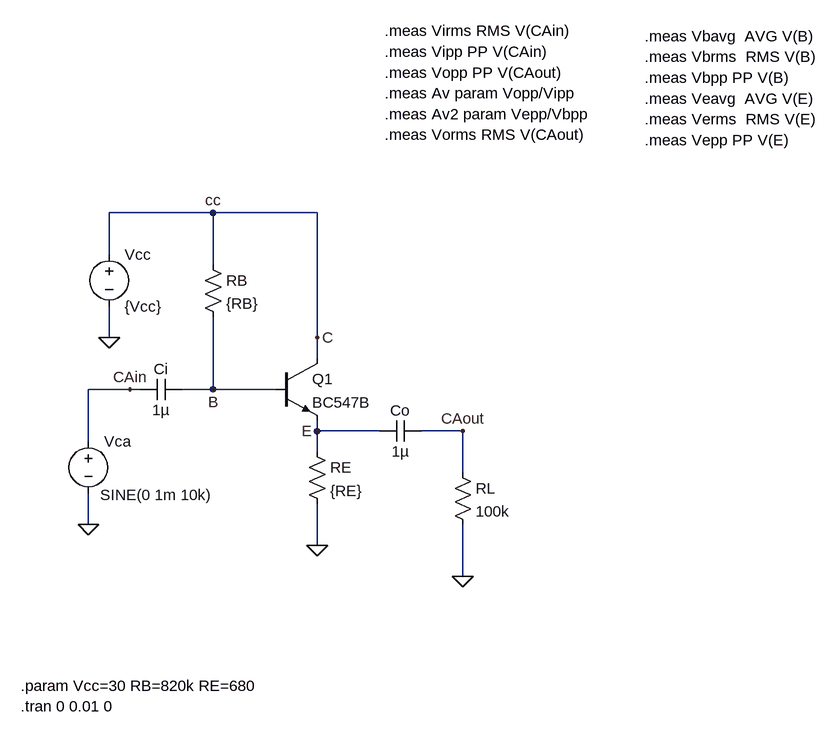
[diagram p0: schematic TBJ03CA.asc]
TBJ03CA.asc, the LTspice schematic file:
Version 4
SHEET 1 1652 1200
WIRE 128 -16 -32 -16
WIRE 288 -16 128 -16
WIRE -32 48 -32 -16
WIRE 128 64 128 -16
WIRE -32 176 -32 128
WIRE 288 176 288 -16
WIRE 288 208 288 176
WIRE 0 256 -64 256
WIRE 16 256 0 256
WIRE 128 256 128 144
WIRE 128 256 80 256
WIRE 224 256 128 256
WIRE 288 320 288 304
WIRE 384 320 288 320
WIRE 512 320 448 320
WIRE -64 336 -64 256
WIRE 288 352 288 320
WIRE 512 384 512 320
WIRE -64 464 -64 416
WIRE 288 496 288 432
WIRE 512 544 512 464
FLAG -32 176 0
FLAG 288 496 0
FLAG -64 464 0
FLAG 128 -16 cc
FLAG 0 256 CAin
FLAG 512 544 0
FLAG 512 320 CAout
FLAG 128 256 B
FLAG 288 176 C
FLAG 288 320 E
SYMBOL res 112 48 R0
SYMATTR InstName RB
SYMATTR Value {RB}
SYMBOL voltage -32 32 R0
WINDOW 123 0 0 Left 0
WINDOW 39 0 0 Left 0
SYMATTR InstName Vcc
SYMATTR Value {Vcc}
SYMBOL npn 224 208 R0
SYMATTR InstName Q1
SYMATTR Value BC547B
SYMBOL cap 80 240 R90
WINDOW 0 0 32 VBottom 2
WINDOW 3 32 32 VTop 2
SYMATTR InstName Ci
SYMATTR Value 1µ
SYMBOL cap 448 304 R90
WINDOW 0 0 32 VBottom 2
WINDOW 3 32 32 VTop 2
SYMATTR InstName Co
SYMATTR Value 1µ
SYMBOL voltage -64 320 R0
WINDOW 123 0 0 Left 0
WINDOW 39 0 0 Left 0
WINDOW 3 18 98 Left 2
SYMATTR Value SINE(0 1m 10k)
SYMATTR InstName Vca
SYMBOL res 496 368 R0
SYMATTR InstName RL
SYMATTR Value 100k
SYMBOL res 272 336 R0
SYMATTR InstName RE
SYMATTR Value {RE}
TEXT -168 744 Left 2 !.tran 0 0.01 0
TEXT -168 712 Left 2 !.param Vcc=30 RB=820k RE=680
TEXT 392 -264 Left 2 !.meas Vipp PP V(CAin)
TEXT 392 -232 Left 2 !.meas Vopp PP V(CAout)
TEXT 392 -200 Left 2 !.meas Av param Vopp/Vipp
TEXT 392 -296 Left 2 !.meas Virms RMS V(CAin)
TEXT 792 -224 Left 2 !.meas Vbpp PP V(B)
TEXT 792 -256 Left 2 !.meas Vbrms  RMS V(B)
TEXT 792 -288 Left 2 !.meas Vbavg  AVG V(B)
TEXT 792 -128 Left 2 !.meas Vepp PP V(E)
TEXT 792 -160 Left 2 !.meas Verms  RMS V(E)
TEXT 792 -192 Left 2 !.meas Veavg  AVG V(E)
TEXT 392 -168 Left 2 !.meas Av2 param Vepp/Vbpp
TEXT 392 -136 Left 2 !.meas Vorms RMS V(CAout)

The netlist it stands for:
* TBJ03CA.asc
RB C B {RB}
Vcc C 0 {Vcc}
Q1 C B E 0 BC547B
Ci B CAin 1µ
Co CAout E 1µ
Vca CAin 0 SINE(0 1m 10k)
RL CAout 0 100k
RE E 0 {RE}
.model NPN NPN
.model PNP PNP
.lib standard.bjt
.tran 0 0.01 0
.param Vcc=30 RB=820k RE=680
.meas Vipp PP V(CAin)
.meas Vopp PP V(CAout)
.meas Av param Vopp/Vipp
.meas Virms RMS V(CAin)
.meas Vbpp PP V(B)
.meas Vbrms  RMS V(B)
.meas Vbavg  AVG V(B)
.meas Vepp PP V(E)
.meas Verms  RMS V(E)
.meas Veavg  AVG V(E)
.meas Av2 param Vepp/Vbpp
.meas Vorms RMS V(CAout)
.backanno
.end